# EAGLE design Main_PCB (EAGLE 8.7.1)
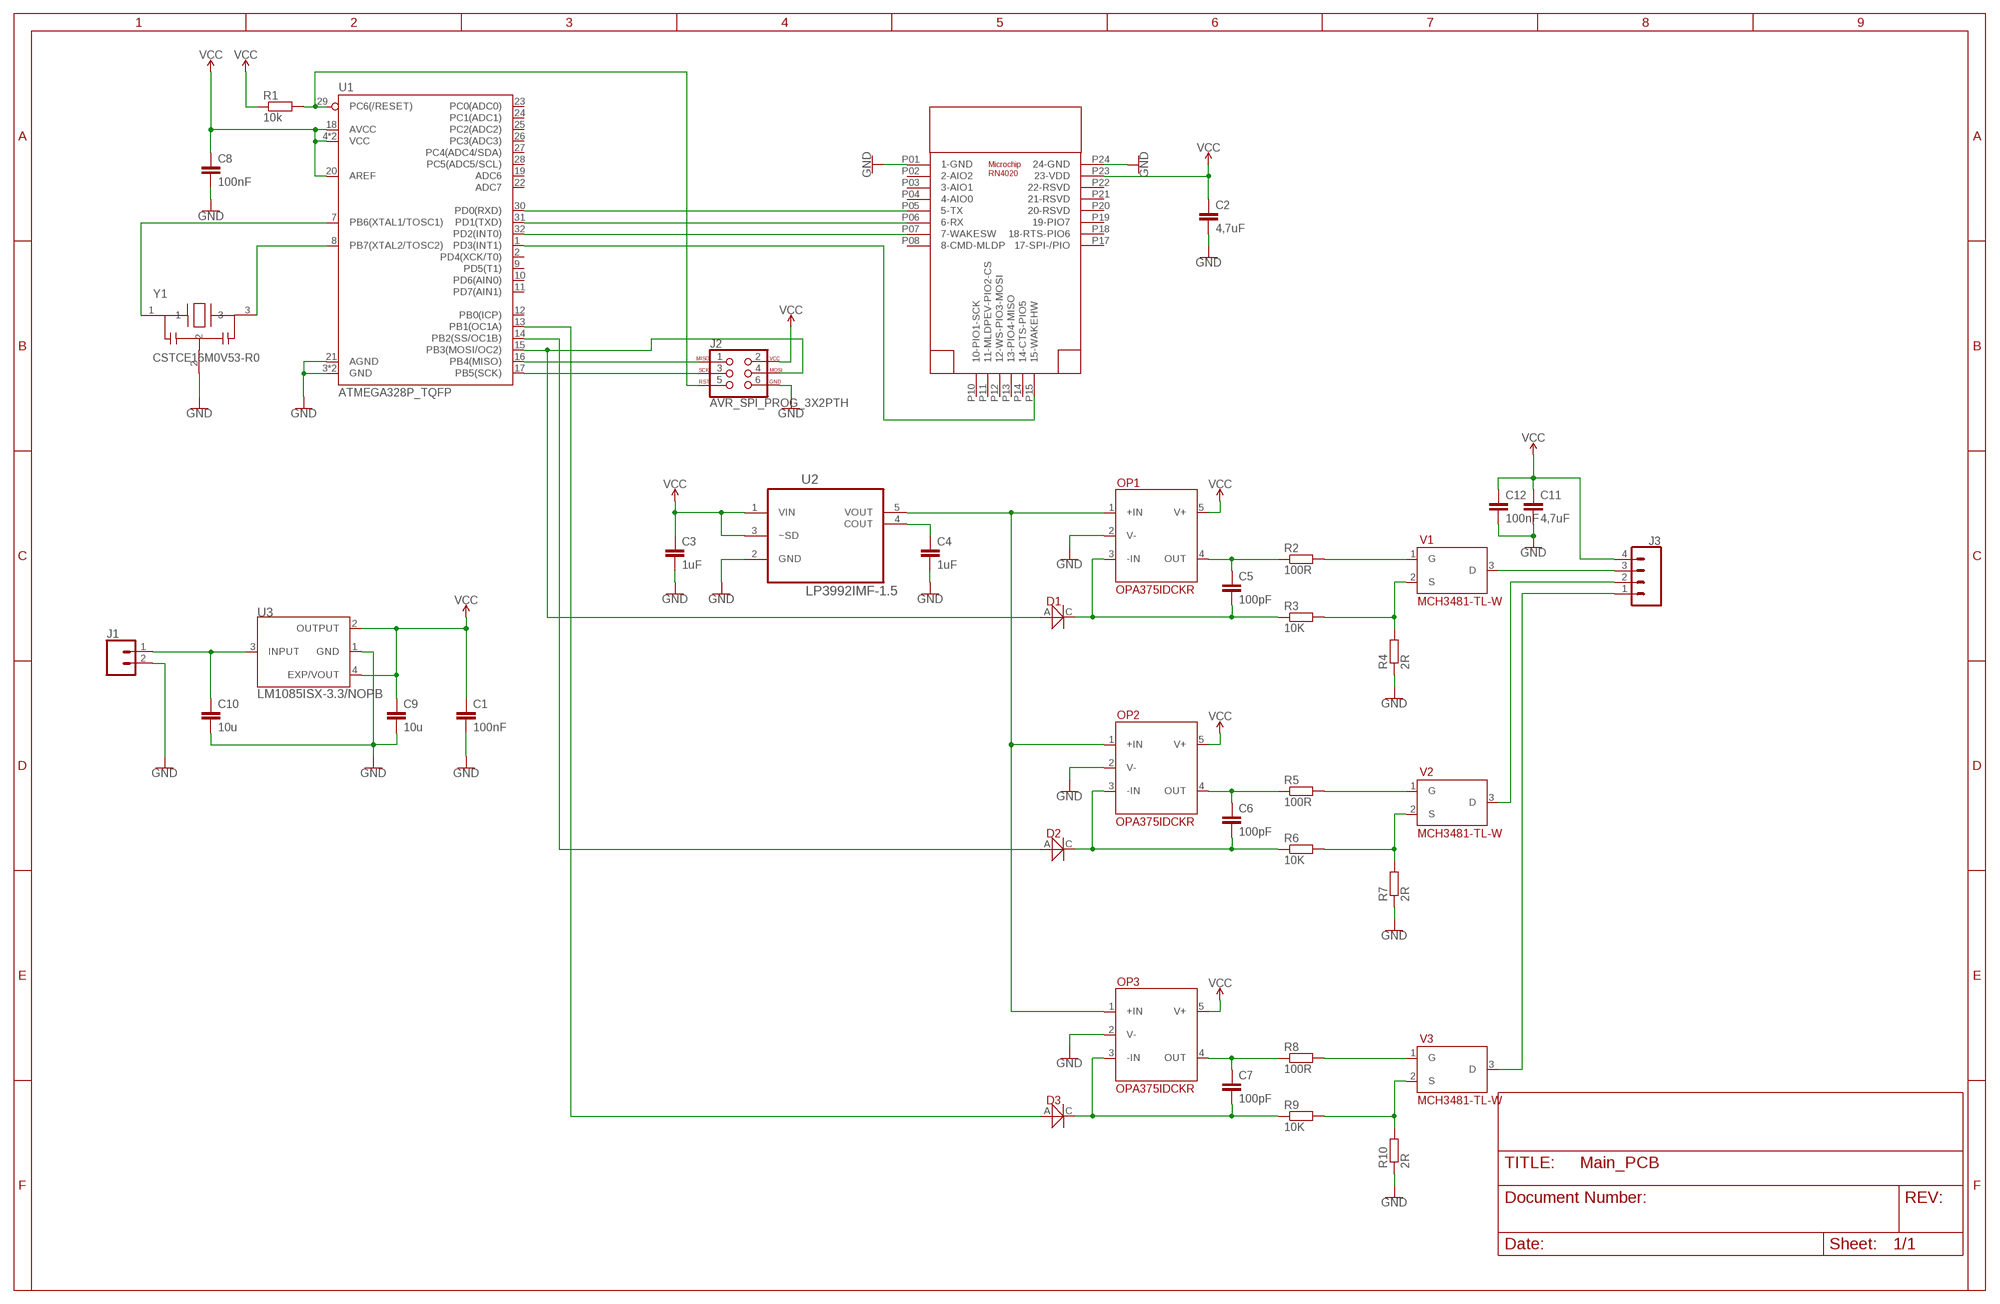
[diagram p0: schematic, sheet 1]

## Parts
C1  100nF  C-EUC0805K  [C0805K]
C2  4,7uF  C-EUC0805K  [C0805K]
C3  1uF  C-EUC0805K  [C0805K]
C4  1uF  C-EUC0805K  [C0805K]
C5  100pF  C-EUC0805K  [C0805K]
C6  100pF  C-EUC0805K  [C0805K]
C7  100pF  C-EUC0805K  [C0805K]
C8  100nF  C-EUC0805K  [C0805K]
C9  10u  C-EUC1206K  [C1206K]
C10  10u  C-EUC1206K  [C1206K]
C11  4,7uF  C-EUC0805K  [C0805K]
C12  100nF  C-EUC0805K  [C0805K]
D1  1N4148WQ-7-F  [SOD-123]
D2  1N4148WQ-7-F  [SOD-123]
D3  1N4148WQ-7-F  [SOD-123]
J1  CONN_02-JST-2MM-SMT  [JST-2-SMD]
J2  AVR_SPI_PROG_3X2PTH  [2X3]
J3  CONN_04SMD  [1X04_SMD_RA_MALE]
OP1  OPA375IDCKR  [SC-70-05]
OP2  OPA375IDCKR  [SC-70-05]
OP3  OPA375IDCKR  [SC-70-05]
R1  10k  R-EU_R0805  [R0805]
R2  100R  R-EU_R0805  [R0805]
R3  10K  R-EU_R0805  [R0805]
R4  2R  R-EU_R1210  [R1210]
R5  100R  R-EU_R0805  [R0805]
R6  10K  R-EU_R0805  [R0805]
R7  2R  R-EU_R1210  [R1210]
R8  100R  R-EU_R0805  [R0805]
R9  10K  R-EU_R0805  [R0805]
R10  2R  R-EU_R1210  [R1210]
U1  ATMEGA328P_TQFP  [TQFP32-08]
U2  LP3992IMF-1.5  [SOT95P284X122-5N]
U3  LM1085ISX-3.3/NOPB  [DPAK254P1435X464-4N]
U$1  RN4020  [RN4020SMD]
V1  MCH3481-TL-W  [SC-70FL]
V2  MCH3481-TL-W  [SC-70FL]
V3  MCH3481-TL-W  [SC-70FL]
Y1  CSTCE16M0V53-R0  [OSC_CSTCE16M0V53-R0]

## Nets
GND [Supply]: C1.2 C2.2 C3.2 C4.2 C8.2 C9.2 C10.2 C11.2 C12.2 J1.2 J2.6 OP1.2(V-) OP2.2(V-) OP3.2(V-) R4.1 R7.1 R10.1 U1.3(GND) U1.5(GND) U1.21(AGND) U2.2(GND) U3.1(GND) U$1.P01(1-GND) U$1.P24(24-GND) Y1.2
N$1: J2.5 R1.2 U1.29(PC6(/RESET))
N$2: U1.30(PD0(RXD)) U$1.P05(5-TX)
N$3: U1.31(PD1(TXD)) U$1.P06(6-RX)
N$4: U1.32(PD2(INT0)) U$1.P07(7-WAKESW)
N$5: U1.1(PD3(INT1)) U$1.P15(15-WAKEHW)
N$6: C4.1 U2.4(COUT)
N$7: OP1.1(+IN) OP2.1(+IN) OP3.1(+IN) U2.5(VOUT)
N$8: C5.1 OP1.4(OUT) R2.1
N$9 [Supply]: R3.2 R4.2 V1.2(S)
N$10: J2.1 U1.16(PB4(MISO))
N$11: R2.2 V1.1(G)
N$12: C5.2 D1.C(CATHODE) OP1.3(-IN) R3.1
N$13: J3.3 V1.3(D)
N$14: C6.2 D2.C(CATHODE) OP2.3(-IN) R6.1
N$15: C6.1 OP2.4(OUT) R5.1
N$16 [Supply]: R6.2 R7.2 V2.2(S)
N$17: U1.8(PB7(XTAL2/TOSC2)) Y1.3
N$18: R5.2 V2.1(G)
N$19 [Supply]: J3.2 V2.3(D)
N$20: C7.2 D3.C(CATHODE) OP3.3(-IN) R9.1
N$21: C7.1 OP3.4(OUT) R8.1
N$22 [Supply]: R9.2 R10.2 V3.2(S)
N$23: U1.7(PB6(XTAL1/TOSC1)) Y1.1
N$24: R8.2 V3.1(G)
N$25 [Supply]: J3.1 V3.3(D)
N$26: D1.A(ANODE) J2.4 U1.15(PB3(MOSI/OC2))
N$27: D2.A(ANODE) U1.14(PB2(SS/OC1B))
N$28: D3.A(ANODE) U1.13(PB1(OC1A))
N$29: J2.3 U1.17(PB5(SCK))
N$31: C10.1 J1.1 U3.3(INPUT)
VCC [Supply]: C1.1 C2.1 C3.1 C8.1 C9.1 C11.1 C12.1 J2.2 J3.4 OP1.5(V+) OP2.5(V+) OP3.5(V+) R1.1 U1.4(VCC) U1.6(VCC) U1.18(AVCC) U1.20(AREF) U2.1(VIN) U2.3(~SD) U3.2(OUTPUT) U3.4(EXP/VOUT) U$1.P23(23-VDD)
Unconnected: U1.2(PD4(XCK/T0)) U1.9(PD5(T1)) U1.10(PD6(AIN0)) U1.11(PD7(AIN1)) U1.12(PB0(ICP)) U1.19(ADC6) U1.22(ADC7) U1.23(PC0(ADC0)) U1.24(PC1(ADC1)) U1.25(PC2(ADC2)) U1.26(PC3(ADC3)) U1.27(PC4(ADC4/SDA)) U1.28(PC5(ADC5/SCL)) U$1.P02(2-AIO2) U$1.P03(3-AIO1) U$1.P04(4-AIO0) U$1.P08(8-CMD-MLDP) U$1.P10(10-PIO1-SCK) U$1.P11(11-MLDPEV-PIO2-CS) U$1.P12(12-WS-PIO3-MOSI) U$1.P13(13-PIO4-MISO) U$1.P14(14-CTS-PIO5) U$1.P17(17-SPI-/PIO) U$1.P18(18-RTS-PIO6) U$1.P19(19-PIO7) U$1.P20(20-RSVD) U$1.P21(21-RSVD) U$1.P22(22-RSVD)

## Library data of the parts
C1-C12 = rcl:C-EU: CAPACITOR, European symbol; SPICEPREFIX: C
D1-D3 = OWN:1N4148WQ-7-F
J1 = SparkFun-Connectors:CONN_02: Multi connection point. Often used as Generic Header-pin footprint for 0.1 inch spaced/style header connections On any of the 0.1 inch spaced packages, you can populate with these: Break Away Headers - Straight <https://www.sparkfun.com/products/116> (PRT-00116) Break Away Male Headers - Right Angle <https://www.sparkfun.com/products/553> (PRT-00553) Female Headers <https://www.sparkfun.com/products/115> (PRT-00115) Break Away Headers - Machine Pin <https://www.sparkfun.com/products/117> (PRT-00117) Break Away Female Headers - Swiss Machine Pin <https://www.sparkfun.com/products/743> (PRT-00743) For SCREWTERMINALS and SPRING TERMINALS visit here: Screw Terimnals on SparkFun.com <https://www.sparkfun.com/search/results?term=Screw+Terminals> (5mm/3.5mm/2.54mm spacing) This device is also useful as a general connection point to wire up your design to another part of your project. Our various solder wires solder well into these plated through hole pads. Hook-Up Wire - Assortment (Stranded, 22 AWG) <https://www.sparkfun.com/products/11375> (PRT-11375) Hook-Up Wire - Assortment (Solid Core, 22 AWG) <https://www.sparkfun.com/products/11367> (PRT-11367) View the entire wire category on our website here <https://www.sparkfun.com/categories/141> Special notes: Molex polarized connector foot print use with: PRT-08233 with associated crimp pins and housings. 2.54_SCREWTERM for use with PRT-10571. 3.5mm Screw Terminal footprints for PRT-08084 5mm Screw Terminal footprints for use with PRT-08432; PROD_ID: CONN-11443
J2 = SparkFun-Connectors:AVR_SPI_PROG_3X2: AVR ISP 6 Pin This is the reduced ISP connector for AVR programming. Common on Arduino. This footprint will take up less PCB space and can be used with a 10-pin to 6-pin adapter such as SKU: BOB-08508 **Special note about "TEST_POINT" package. The stop mask is on the top side, so if you want your programming test points to be on the bottom of your board, make sure to place this package on the bottom side of the board. This also ensure that the orientation to program from the bottom side will be correct. SparkFun Products: SparkFun ISP Pogo Adapter <https://www.sparkfun.com/products/11591> - NS Tiny AVR Programmer <https://www.sparkfun.com/products/11801> -PTH
J3 = SparkFun-Connectors:CONN_04: Multi connection point. Often used as Generic Header-pin footprint for 0.1 inch spaced/style header connections On any of the 0.1 inch spaced packages, you can populate with these: Break Away Headers - Straight <https://www.sparkfun.com/products/116> (PRT-00116) Break Away Male Headers - Right Angle <https://www.sparkfun.com/products/553> (PRT-00553) Female Headers <https://www.sparkfun.com/products/115> (PRT-00115) Break Away Headers - Machine Pin <https://www.sparkfun.com/products/117> (PRT-00117) Break Away Female Headers - Swiss Machine Pin <https://www.sparkfun.com/products/743> (PRT-00743) For SCREWTERMINALS and SPRING TERMINALS visit here: Screw Terimnals on SparkFun.com <https://www.sparkfun.com/search/results?term=Screw+Terminals> (5mm/3.5mm/2.54mm spacing) This device is also useful as a general connection point to wire up your design to another part of your project. Our various solder wires solder well into these plated through hole pads. Hook-Up Wire - Assortment (Stranded, 22 AWG) <https://www.sparkfun.com/products/11375> (PRT-11375) Hook-Up Wire - Assortment (Solid Core, 22 AWG) <https://www.sparkfun.com/products/11367> (PRT-11367) View the entire wire category on our website here <https://www.sparkfun.com/categories/141> Special notes: Molex polarized connector foot print use with SKU : PRT-08231 with associated crimp pins and housings. 1MM SMD Version SKU: PRT-10208; PROD_ID: CONN-09140; SF_ID: PRT-12638
OP1-OP3 = OPA375IDCKR:OPA375IDCKR: Texas Instrument Operationsverstärker OPA375IDCKR
R1-R10 = rcl:R-EU_: RESISTOR, European symbol; SPICEPREFIX: R
U1 = SparkFun-IC-Microcontroller:ATMEGA328P_TQFP: Popular 328P in QFP Storefront component: ATmega328 - TQFP <https://www.sparkfun.com/products/13448> (COM-13448) Datasheet <http://www.sparkfun.com/datasheets/Components/SMD/ATMega328.pdf> SparkFun Products SparkFun RedBoard - Programmed with Arduino <https://www.sparkfun.com/products/12757> (DEV-12757) Arduino Pro Mini 328 - 5V/16MHz <https://www.sparkfun.com/products/11113> (DEV-11113) Arduino Pro Mini 328 - 3.3V/8MHz <https://www.sparkfun.com/products/11114> (DEV-11114) SparkFun OpenLog <https://www.sparkfun.com/products/13712> (DEV-13712) SparkFun MicroView - OLED Arduino Module <https://www.sparkfun.com/products/12923> (DEV-12923) SparkFun Digital Sandbox <https://www.sparkfun.com/products/12651> (DEV-12651) SparkFun PicoBoard <https://www.sparkfun.com/products/11888> (WIG-11888) Arduino Fio <https://www.sparkfun.com/products/10116> (DEV-10116) LilyPad Arduino 328 Main Board <https://www.sparkfun.com/products/13342> (DEV-13342) SparkFun RedStick <https://www.sparkfun.com/products/13741> (DEV-13741) LilyPad MP3 <https://www.sparkfun.com/products/11013> (DEV-11013) LilyPad Arduino SimpleSnap <https://www.sparkfun.com/products/10941> (DEV-10941) SparkFun Stepoko <https://www.sparkfun.com/products/13899> (ROB-13899) SparkFun Geiger Counter <https://www.sparkfun.com/products/11345> (SEN-11345) SparkFun EL Sequencer <https://www.sparkfun.com/products/12781> (COM-12781) Arduino Pro 328 - 5V/16MHz <https://www.sparkfun.com/products/10915> (DEV-10915) CryptoCape <https://www.sparkfun.com/products/12773> (DEV-12773) SparkFun IR Thermometer Evaluation Board - MLX90614 <https://www.sparkfun.com/products/10740> (SEN-10740) SparkFun RedBot Mainboard <https://www.sparkfun.com/products/12097> (ROB-12097) Arduino Pro 328 - 3.3V/8MHz <https://www.sparkfun.com/products/10914> (DEV-10914) SparkFun Block for Intel® Edison - Arduino <https://www.sparkfun.com/products/13036> (DEV-13036) SparkFun Simon Says - Surface Mount Soldering Kit <https://www.sparkfun.com/products/10935> (KIT-10935) SparkFun 7-Segment Serial Display - Red <https://www.sparkfun.com/products/11441> (COM-11441) SparkFun 7-Segment Serial Display - White <https://www.sparkfun.com/products/11629> (COM-11629) SparkFun 7-Segment Serial Display - Yellow <https://www.sparkfun.com/products/11443> (COM-11443) SparkFun 7-Segment Serial Display - Kelly Green <https://www.sparkfun.com/products/11440> (COM-11440) SparkFun 7-Segment Serial Display - Blue <https://www.sparkfun.com/products/11442> (COM-11442) SparkFun OpenSegment Serial Display - 20mm (Blue) <https://www.sparkfun.com/products/11647> (COM-11647) SparkFun OpenSegment Serial Display - 20mm (Green) <https://www.sparkfun.com/products/11646> (COM-11646) SparkFun OpenSegment Serial Display - 20mm (White) <https://www.sparkfun.com/products/11648> (COM-11648) SparkFun OpenSegment Serial Display - 20mm (Red) <https://www.sparkfun.com/products/11644> (COM-11644) SparkFun OpenSegment Serial Display - 20mm (Yellow) <https://www.sparkfun.com/products/11645> (COM-11645) SparkFun OpenSegment Shield <https://www.sparkfun.com/products/13190> (DEV-13190); PROD_ID: IC-09069
U2 = LP3992IMF-1.5:LP3992IMF-1.5: Voltage Regulator; AVAILABILITY: Unavailable; DESCRIPTION: LDO, FIXED, 1.5V, 30mA, 5.2V, SOT-23-5; MF: Texas Instruments; MP: LP3992IMF-1.5; PACKAGE: SOT-23 Texas Instruments; PRICE: None
U3 = LM1085ISX-3.3_NOPB:LM1085ISX-3.3/NOPB: 3A Low Dropout Positive egulators 3-DDPAK/TO-263 -40 to 125; DESCRIPTION: 3A Low Dropout Positive egulators 3-DDPAK/TO-263 -40 to 125; DIGI-KEY_PART_NUMBER: LM1085ISX-3.3/NOPBCT-ND; DIGI-KEY_PURCHASE_URL: https://www.digikey.de/product-detail/en/texas-instruments/LM1085ISX-3.3-NOPB/LM1085ISX-3.3-NOPBCT-ND/3440093?WT.z_cid=ref_snapeda&utm_source=snapeda&utm_medium=aggregator&utm_campaign=buynow; MF: Texas Instruments; MP: LM1085ISX-3.3/NOPB; PACKAGE: TO-263-3 Texas Instruments
U$1 = microchip_bluetooth_v101:RN4020
V1-V3 = OWN:MCH3481-TL-W: MOSFET von ON Semiconductor MCH3481-TL-W
Y1 = CSTCE16M0V53-R0:CSTCE16M0V53-R0: Ceramic Resonator 16MHz ±0.5% (Tol) ±0.3% (Stability) 15pF 40Ohm 3-Pin CSMD T/R; DESCRIPTION: Ceramic Resonator 16MHz ??0.5% _Tol_ ??0.3% _Stability_ 15pF 40Ohm 3-Pin CSMD T/R; DIGI-KEY_PART_NUMBER: 490-1198-1-ND; DIGI-KEY_PURCHASE_URL: https://www.digikey.de/product-detail/en/murata-electronics-north-america/CSTCE16M0V53-R0/490-1198-1-ND/584635?WT.z_cid=ref_snapeda&utm_source=snapeda&utm_medium=aggregator&utm_campaign=buynow; MF: Murata; MP: CSTCE16M0V53-R0; PACKAGE: SMD-3 Murata

## Net classes
0 Signals: clearance 0.127 mm
1 Supply: clearance 0.127 mm

## Board
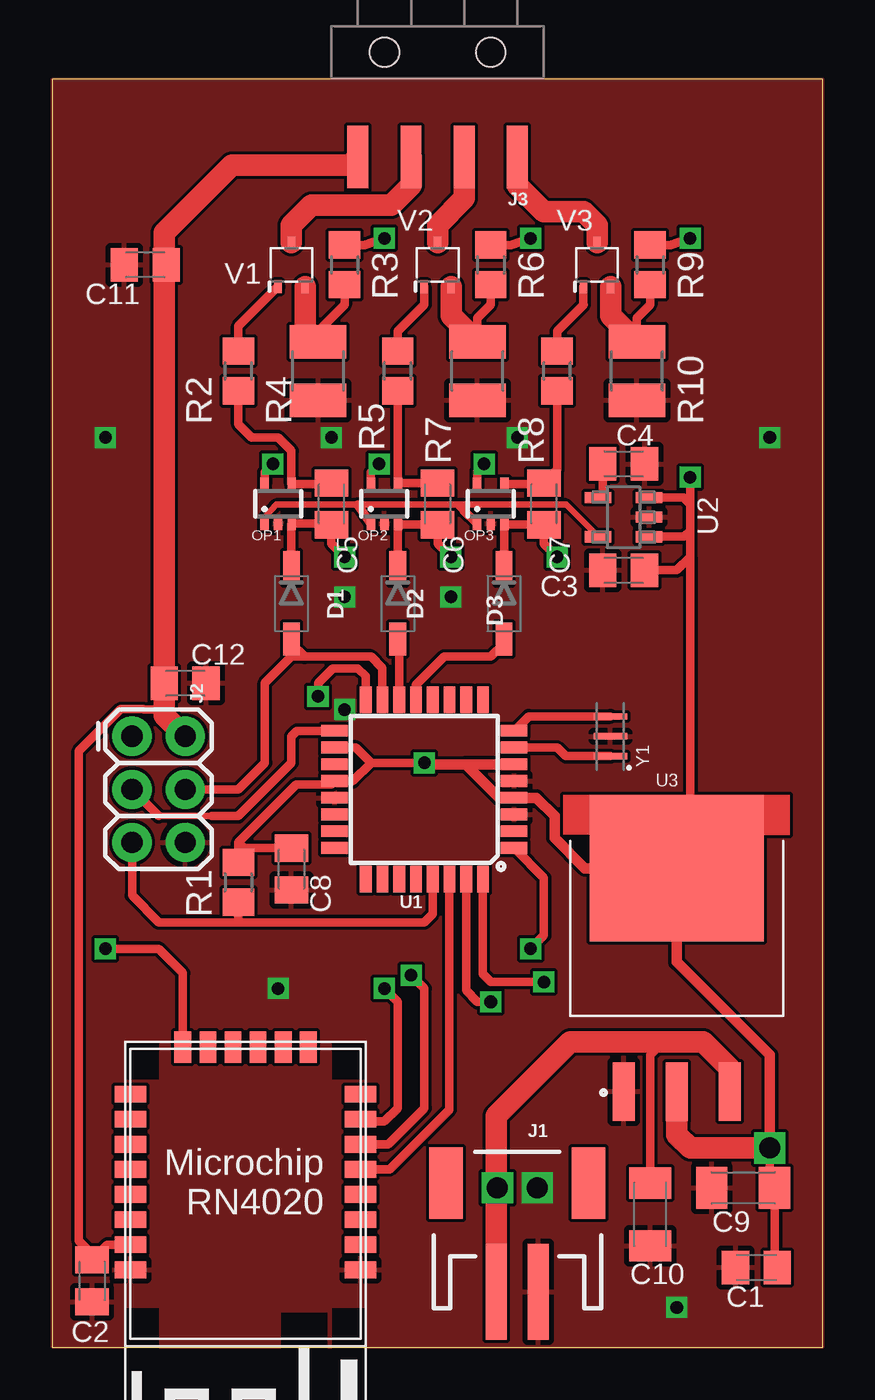
[diagram p1: board, top side]
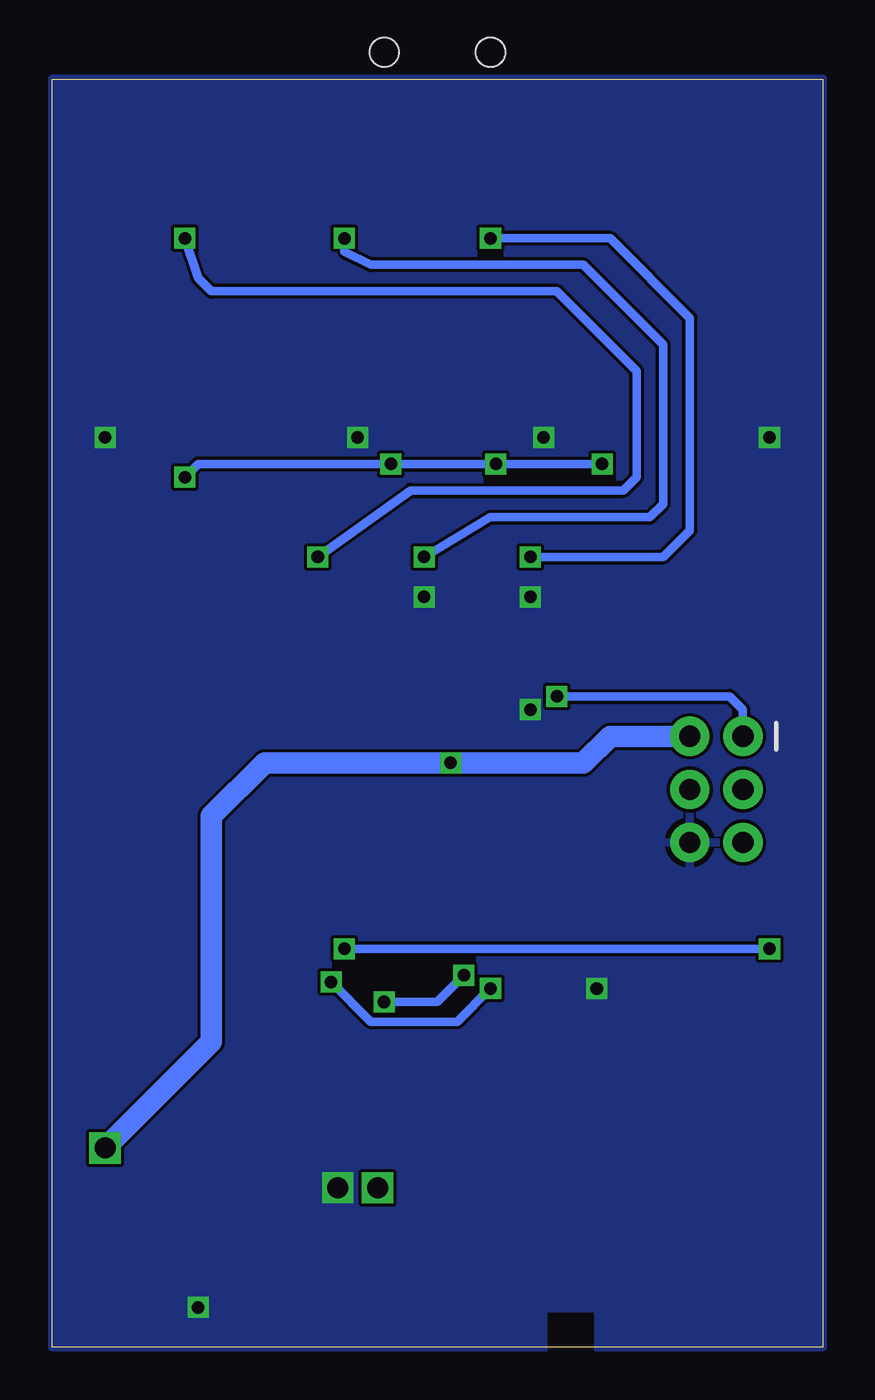
[diagram p2: board, bottom side, seen from below]

Size 36.82 x 60.63 mm. Coordinates in mm from the lower left corner, seen from the top.
Outline: 0,0 36.82,0 36.82,60.63 0,60.63 0,0
Copper layers (1*16): Top 0.035mm / dielectric 1.5mm / Bottom 0.035mm
Design rules "default *": minimum track width 6mil, minimum drill 0.35mm, track to track 6mil, track to pad 6mil, pad to pad 6mil, via to via 6mil, smd to smd 6mil, copper to edge 0mil, drill to drill 6mil, minimum pad ring 10mil, minimum via ring 8mil, stop-mask expansion 4mil, vias tented up to drill 0mil, thermal gap 10mil

### Footprints (pad centres in the part's own frame; a part is rotated, then mirrored left to right if it is on the bottom)
C0805K = smd 1.3 x 1.6: 1 -1,0; 2 1,0
C1206K = smd 1.5 x 2: 1 -1.5,0; 2 1.5,0
SOD-123 = smd 1.6 x 0.8: A 1.7,0; C -1.7,0
JST-2-SMD = smd 1 x 4.6: 1 -1,-3.7; 2 1,-3.7 | smd 1.6 x 3.4: NC1 -3.4,1.5; NC2 3.4,1.5
2X3 = drill 1.016 pad 1.88: 1 0,0; 2 0,2.54; 3 2.54,0; 4 2.54,2.54; 5 5.08,0; 6 5.08,2.54
1X04_SMD_RA_MALE = smd 1 x 3: 1 -3.81,5; 2 -1.27,5; 3 1.27,5; 4 3.81,5 | hole 1.4: -2.54,0; 2.54,0
SC-70-05 = smd 0.4 x 0.6: 1 -0.65,-0.95; 2 0,-0.95; 3 0.65,-0.95; 4 0.65,0.95; 5 -0.65,0.95
R0805 = smd 1.3 x 1.5: 1 -0.95,0; 2 0.95,0
R1210 = smd 1.6 x 2.7: 1 -1.4,0; 2 1.4,0
TQFP32-08 = smd 1.27 x 0.559: 1 -4.293,2.8; 2 -4.293,2; 3 -4.293,1.2; 4 -4.293,0.4; 5 -4.293,-0.4; 6 -4.293,-1.2; 7 -4.293,-2; 8 -4.293,-2.8; 17 4.293,-2.8; 18 4.293,-2; 19 4.293,-1.2; 20 4.293,-0.4; 21 4.293,0.4; 22 4.293,1.2; 23 4.293,2; 24 4.293,2.8 | smd 0.559 x 1.27: 9 -2.8,-4.293; 10 -2,-4.293; 11 -1.2,-4.293; 12 -0.4,-4.293; 13 0.4,-4.293; 14 1.2,-4.293; 15 2,-4.293; 16 2.8,-4.293; 25 2.8,4.293; 26 2,4.293; 27 1.2,4.293; 28 0.4,4.293; 29 -0.4,4.293; 30 -1.2,4.293; 31 -2,4.293; 32 -2.8,4.293
SOT95P284X122-5N = smd 1.27 x 0.533: 1 -1.219,0.94; 2 -1.219,0; 3 -1.219,-0.94; 4 1.219,-0.94; 5 1.219,0.94
DPAK254P1435X464-4N = smd 1.05 x 2.79: 1 -2.54,-6.19; 2 0,-6.19; 3 2.54,-6.19 | smd 8.33 x 6.99: 4 0,4.485
RN4020SMD = smd 1.5 x 0.8: P01 0.25,10.9; P02 0.25,9.7; P03 0.25,8.5; P04 0.25,7.3; P05 0.25,6.1; P06 0.25,4.9; P07 0.25,3.7; P08 0.25,2.5; P17 11.25,2.5; P18 11.25,3.7; P19 11.25,4.9; P20 11.25,6.1; P21 11.25,7.3; P22 11.25,8.5; P23 11.25,9.7; P24 11.25,10.9 | smd 0.8 x 1.5: P10 2.75,0.25; P11 3.95,0.25; P12 5.15,0.25; P13 6.35,0.25; P14 7.55,0.25; P15 8.75,0.25
SC-70FL = smd 0.4 x 0.6: 1 -0.65,-1.05; 2 0.65,-1.05; 3 0,1.05
OSC_CSTCE16M0V53-R0 = smd 0.3 x 1.6: 1 -0.95,0; 2 0,0; 3 0.95,0

### Placement (x,y rotation side)
C1  33.66,3.81 180 top
C2  1.91,3.17 270 top
C3  27.3,37.15 180 top
C4  27.3,42.23 0 top
C5  13.34,40.32 270 top
C6  18.41,40.32 270 top
C7  23.5,40.32 270 top
C8  11.43,22.86 270 top
C9  33.02,7.62 180 top
C10  28.57,6.35 270 top
C11  4.45,51.75 180 top
C12  6.35,31.75 0 top
D1  11.43,35.56 270 top
D2  16.51,35.56 270 top
D3  21.59,35.56 270 top
J1  22.23,6.35 0 top
J2  3.81,29.21 270 top
J3  18.41,61.91 180 top
OP1  10.79,40.32 0 top
OP2  15.88,40.32 0 top
OP3  20.95,40.32 0 top
R1  8.89,22.22 270 top
R2  8.89,46.67 90 top
R3  13.97,51.75 270 top
R4  12.7,46.67 90 top
R5  16.51,46.67 90 top
R6  20.95,51.75 270 top
R7  20.32,46.67 90 top
R8  24.13,46.67 90 top
R9  28.57,51.75 270 top
R10  27.94,46.67 90 top
U1  17.78,26.67 180 top
U2  27.3,39.69 180 top
U3  29.84,18.41 0 top
U$1  14.99,14.61 180 top
V1  11.43,51.75 0 top
V2  18.41,51.75 0 top
V3  26.04,51.75 0 top
Y1  26.67,29.21 90 top

### Tracks (layer width: path | path; a pad name or v marks a point on that pad's centre or on a via)
GND  (via drill 0.6, 1)
  other vias: 13.34,43.5 22.23,43.5 13.97,35.88 19.05,35.88 13.97,30.48 10.79,17.14 34.29,43.5 2.54,43.5 29.84,1.91 23.18,7.62
  pour Top: 0,60.64 36.83,60.64 36.83,0 0,0
  pour Bottom: 0,60.64 36.83,60.64 36.83,0 0,0
N$1
  Top 0.406: J2.5 3.81,21.59 5.08,20.32 8.89,20.32 | 8.89,20.32 17.78,20.32 18.18,20.72 U1.29 | R1.2 8.89,20.32
N$2
  Top 0.406: U1.30 18.98,11.36 16.12,8.5 U$1.P05
N$3  (via drill 0.6)
  Top 0.406: U$1.P06 16.05,9.7 17.78,11.43 17.78,17.14 v17.14,17.78 | v20.95,16.51 20.32,16.51 19.78,17.05 U1.31
  Bottom 0.406: v17.14,17.78 18.41,16.51 v20.95,16.51
N$4  (via drill 0.6)
  Top 0.406: U$1.P07 14.85,10.79 15.88,10.79 16.51,11.43 16.51,16.51 v15.88,17.14 | v23.5,17.46 20.95,17.46 20.58,17.84 U1.32
  Bottom 0.406: v15.88,17.14 17.46,15.56 21.59,15.56 v23.5,17.46
N$5  (via drill 0.6)
  Top 0.406: U$1.P15 6.24,17.89 5.08,19.05 v2.54,19.05 | U1.1 23.5,22.45 23.5,19.68 v22.86,19.05
  Bottom 0.406: v2.54,19.05 v22.86,19.05
N$6
  Top 0.406: U2.4 26.3,40.85 C4.1
N$7
  Top 0.305: 19.34,40.28 14.61,40.28 10.7,40.28 10.48,40.04 10.16,39.69 arc85 10.16,39.39 | 19.65,40.03 19.59,40.03 19.34,40.28 | U2.5 24.56,40.28 19.34,40.28
  Top 0.406: OP3.1 19.65,40.03 | 10.16,39.39 OP1.1 | OP2.1 14.61,40.28
N$8
  Top 0.406: C5.1 13.29,41.27 OP1.4 11.43,41.29 11.43,42.86 10.79,43.5 9.53,43.5 8.89,44.13 R2.1
N$9
  Top 0.406: R3.2 13.97,49.85 12.7,48.58 R4.2
  Top 1.016: V1.2 12.08,48.69 R4.2
N$10  (via drill 0.6)
  Top 0.406: U1.16 14.98,32.09 14.61,32.46 13.41,32.46 12.7,31.75 v12.7,31.11
  Bottom 0.406: v12.7,31.11 4.45,31.11 3.81,30.48 J2.1
N$11
  Top 0.406: R2.2 8.89,48.81 V1.1
N$12  (via drill 0.6)
  Top 0.406: v15.88,53.02 14.92,52.7 R3.1 | D1.C 11.43,39.36 OP1.3 13.29,39.37 C5.2 13.34,38.42 v13.97,37.78
  Bottom 0.406: v13.97,37.78 7.62,37.78 6.35,39.05 6.35,49.21 10.16,53.02 v15.88,53.02
N$13
  Top 1.016: V1.3 11.43,53.66 12.38,54.61 16.19,54.61 17.14,55.56 J3.3
N$14  (via drill 0.6)
  Top 0.406: OP2.3 16.51,39.36 16.55,39.32 | 16.55,39.32 C6.2 18.41,38.42 v19.05,37.78 | v22.86,53.02 21.91,52.7 R6.1 | D2.C 16.51,39.29 16.55,39.32
  Bottom 0.406: v19.05,37.78 15.88,39.69 8.26,39.69 7.62,40.32 7.62,47.94 11.43,51.75 21.59,51.75 22.86,52.39 v22.86,53.02
N$15
  Top 0.406: C6.1 16.57,41.32 OP2.4 16.51,41.29 R5.1
N$16
  Top 0.406: R6.2 20.95,49.85 20.32,49.21 R7.2
  Top 1.016: V2.2 19.07,49.33 R7.2
N$17
  Top 0.406: U1.8 22.76,30.16 Y1.3
N$18
  Top 0.406: V2.1 17.77,49.86 17.78,49.85 16.51,48.58 R5.2
N$19
  Top 1.016: V2.3 18.41,53.66 19.68,54.93 J3.2
N$20  (via drill 0.6)
  Top 0.406: v30.48,53.02 29.52,52.7 R9.1 | D3.C 21.59,39.36 OP3.3 21.66,39.32 C7.2 23.5,38.42 v24.13,37.78
  Bottom 0.406: v24.13,37.78 19.68,40.96 9.53,40.96 8.89,41.59 8.89,46.67 12.7,50.48 29.21,50.48 29.84,51.12 v30.48,53.02
N$21
  Top 0.406: R8.1 24.13,41.96 C7.1 23.45,41.27 OP3.4
N$22
  Top 0.406: R9.2 28.57,49.85 27.94,49.21 R10.2
  Top 0.508: 27.18,48.07 R10.2 27.94,48.58 | V3.2 26.67,50.69
  Top 1.016: V3.2 26.68,49.33 R10.2
N$23
  Top 0.406: U1.7 24.13,28.67 24.54,28.26 Y1.1
N$24
  Top 0.406: 24.11,47.64 R8.2 24.13,48.58 25.4,49.85 25.39,49.86 V3.1
N$25
  Top 1.016: V3.3 26.04,53.66 25.4,54.29 23.5,54.29 22.23,55.56 J3.1
N$26
  Top 0.406: U1.15 15.78,32.48 15.24,33.02 12.06,33.02 | 12.06,33.02 11.43,33.02 10.16,31.75 10.16,27.94 8.89,26.67 J2.4 | D1.A 11.43,33.66 12.06,33.02
N$27
  Top 0.406: U1.14 16.58,33.79 D2.A
N$28
  Top 0.406: U1.13 17.38,31.67 18.73,33.02 20.95,33.02 21.59,33.66 D3.A
N$29
  Top 0.305: 5.08,25.4 7.62,25.4
  Top 0.406: J2.3 5.08,25.4 | 7.62,25.4 8.89,25.4 11.43,27.94 11.43,29.21 11.69,29.47 U1.17
N$31  (via drill 1)
  Top 0.406: C10.1 28.57,13.97 29.21,14.61
  Top 0.508: v21.27,7.62 21.23,7.62
  Top 1.016: J1.1 21.23,7.62 21.23,11.06 24.77,14.61 29.21,14.61 31.11,14.61 32.38,13.33 U3.3
VCC  (via drill 0.6, 1)
  Top 0.406: 15.24,27.94 14.37,27.07 U1.20 13.32,26.9 11.66,26.9 8.89,24.13 | 15.24,27.94 14.51,28.67 U1.18 | v17.78,27.94 15.24,27.94 | 21.99,26.35 U1.4 | 9.21,22.86 R1.1 8.89,24.13 | OP3.5 20.3,41.9 v20.64,42.23 | v15.62,42.23 15.22,41.83 OP2.5 | v10.54,42.23 10.14,41.83 OP1.5 | U2.1 30.18,38.75 30.48,39.05 | 30.48,39.05 30.48,40.32 | 30.48,40.96 v30.48,41.59 30.48,40.32 | 30.48,40.32 30.45,40.32 | C3.1 29.84,37.15 30.48,37.78 | 30.48,37.78 30.48,39.05 | U2.3 30.18,40.63 30.48,40.32 | U$1.P23 2.63,4.91 C2.1 1.91,4.44 1.27,5.08 1.27,28.5 3.27,30.5 4.35,30.5 4.37,30.48 5.08,30.48 5.35,30.21 | 29.84,21.59 30.48,22.22 30.48,37.78 | C8.1 9.16,23.86 8.89,24.13 | C1.1 34.52,3.94 C9.1 34.29,7.85 v34.29,9.52 34.29,10.16
  Top 0.508: 34.29,10.16 34.29,13.97 29.84,18.41 29.84,21.59 U3.4 25.46,22.9 24.01,24.35 24.01,25.4 23.14,26.27 U1.4 21.36,26.27 19.75,27.87 | v17.78,27.94 17.85,27.87 19.75,27.87 | U1.6 19.75,27.87
  Top 1.016: J2.2 5.35,30.21 C12.1 5.35,51.75 | 5.35,51.75 5.35,53.29 8.57,56.52 14.21,56.52 J3.4 | U3.2 29.84,10.16 30.48,9.52 v34.29,9.52 | C11.1 5.35,51.75
  Bottom 0.406: v10.54,42.23 v15.62,42.23 v20.64,42.23 29.84,42.23 v30.48,41.59
  Bottom 1.016: v34.29,9.52 29.21,14.61 29.21,25.4 26.67,27.94 11.43,27.94 10.16,29.21 J2.2